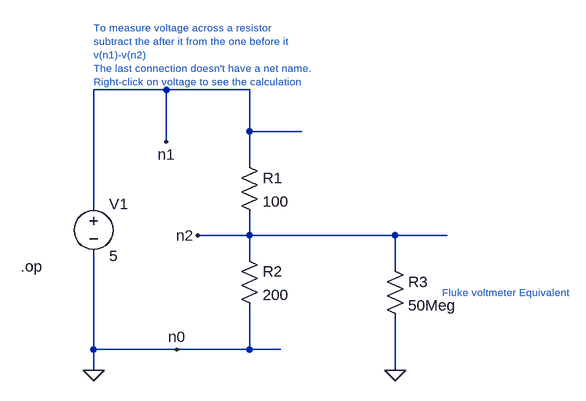
[diagram p0: schematic VoltageDivider02.asc]
VoltageDivider02.asc, the LTspice schematic file:
Version 4
SHEET 1 880 680
WIRE 160 -144 48 -144
WIRE 288 -144 160 -144
WIRE 288 -80 288 -144
WIRE 368 -80 288 -80
WIRE 160 -64 160 -144
WIRE 288 -32 288 -80
WIRE 48 32 48 -144
WIRE 288 80 288 48
WIRE 288 80 208 80
WIRE 512 80 288 80
WIRE 592 80 512 80
WIRE 288 112 288 80
WIRE 512 128 512 80
WIRE 48 256 48 112
WIRE 176 256 48 256
WIRE 288 256 288 192
WIRE 288 256 176 256
WIRE 336 256 288 256
WIRE 48 288 48 256
WIRE 512 288 512 208
FLAG 48 288 0
FLAG 208 80 n2
FLAG 160 -64 n1
FLAG 176 256 n0
FLAG 512 288 0
DATAFLAG 416 16 "V(n1)-V(n2)"
DATAFLAG 192 160 "V(n2)"
DATAFLAG 448 80 "$"
DATAFLAG 160 -96 ""
DATAFLAG 368 -80 "round(I(R1)*100k)/100k"
DATAFLAG 592 80 "Round(I(R3))"
DATAFLAG 336 256 "round(I(R2)*100k)/100k"
SYMBOL voltage 48 16 R0
WINDOW 123 0 0 Left 0
WINDOW 39 0 0 Left 0
SYMATTR InstName V1
SYMATTR Value 5
SYMBOL res 272 -48 R0
SYMATTR InstName R1
SYMATTR Value 100
SYMBOL res 272 96 R0
SYMATTR InstName R2
SYMATTR Value 200
SYMBOL res 496 112 R0
SYMATTR InstName R3
SYMATTR Value 50Meg
TEXT -64 128 Left 2 !.op
TEXT 48 -240 Left 1 ;To measure voltage across a resistor\nsubtract the after it from the one before it\nv(n1)-v(n2)\nThe last connection doesn't have a net name.\nRight-click on voltage to see the calculation
TEXT 584 168 Left 1 ;Fluke voltmeter Equivalent

The netlist it stands for:
* VoltageDivider02.asc
V1 n1 0 5
R1 n1 n2 100
R2 n2 0 200
R3 n2 0 50Meg
.op
* To measure voltage across a resistor
* subtract the after it from the one before it
* v(n1)-v(n2)
* The last connection doesn't have a net name.
* Right-click on voltage to see the calculation
* Fluke voltmeter Equivalent
.backanno
.end

* Results of the author's LTspice run, read from the files saved beside the schematic
* Operating Point:
*   V(n1) = 5 V
*   V(n2) = 3.333 V
*   I(R3) = 66.67 nA
*   I(R2) = 16.67 mA
*   I(R1) = 16.67 mA
*   I(V1) = -16.67 mA